# EAGLE schematic Switch (EAGLE 7.6.0)
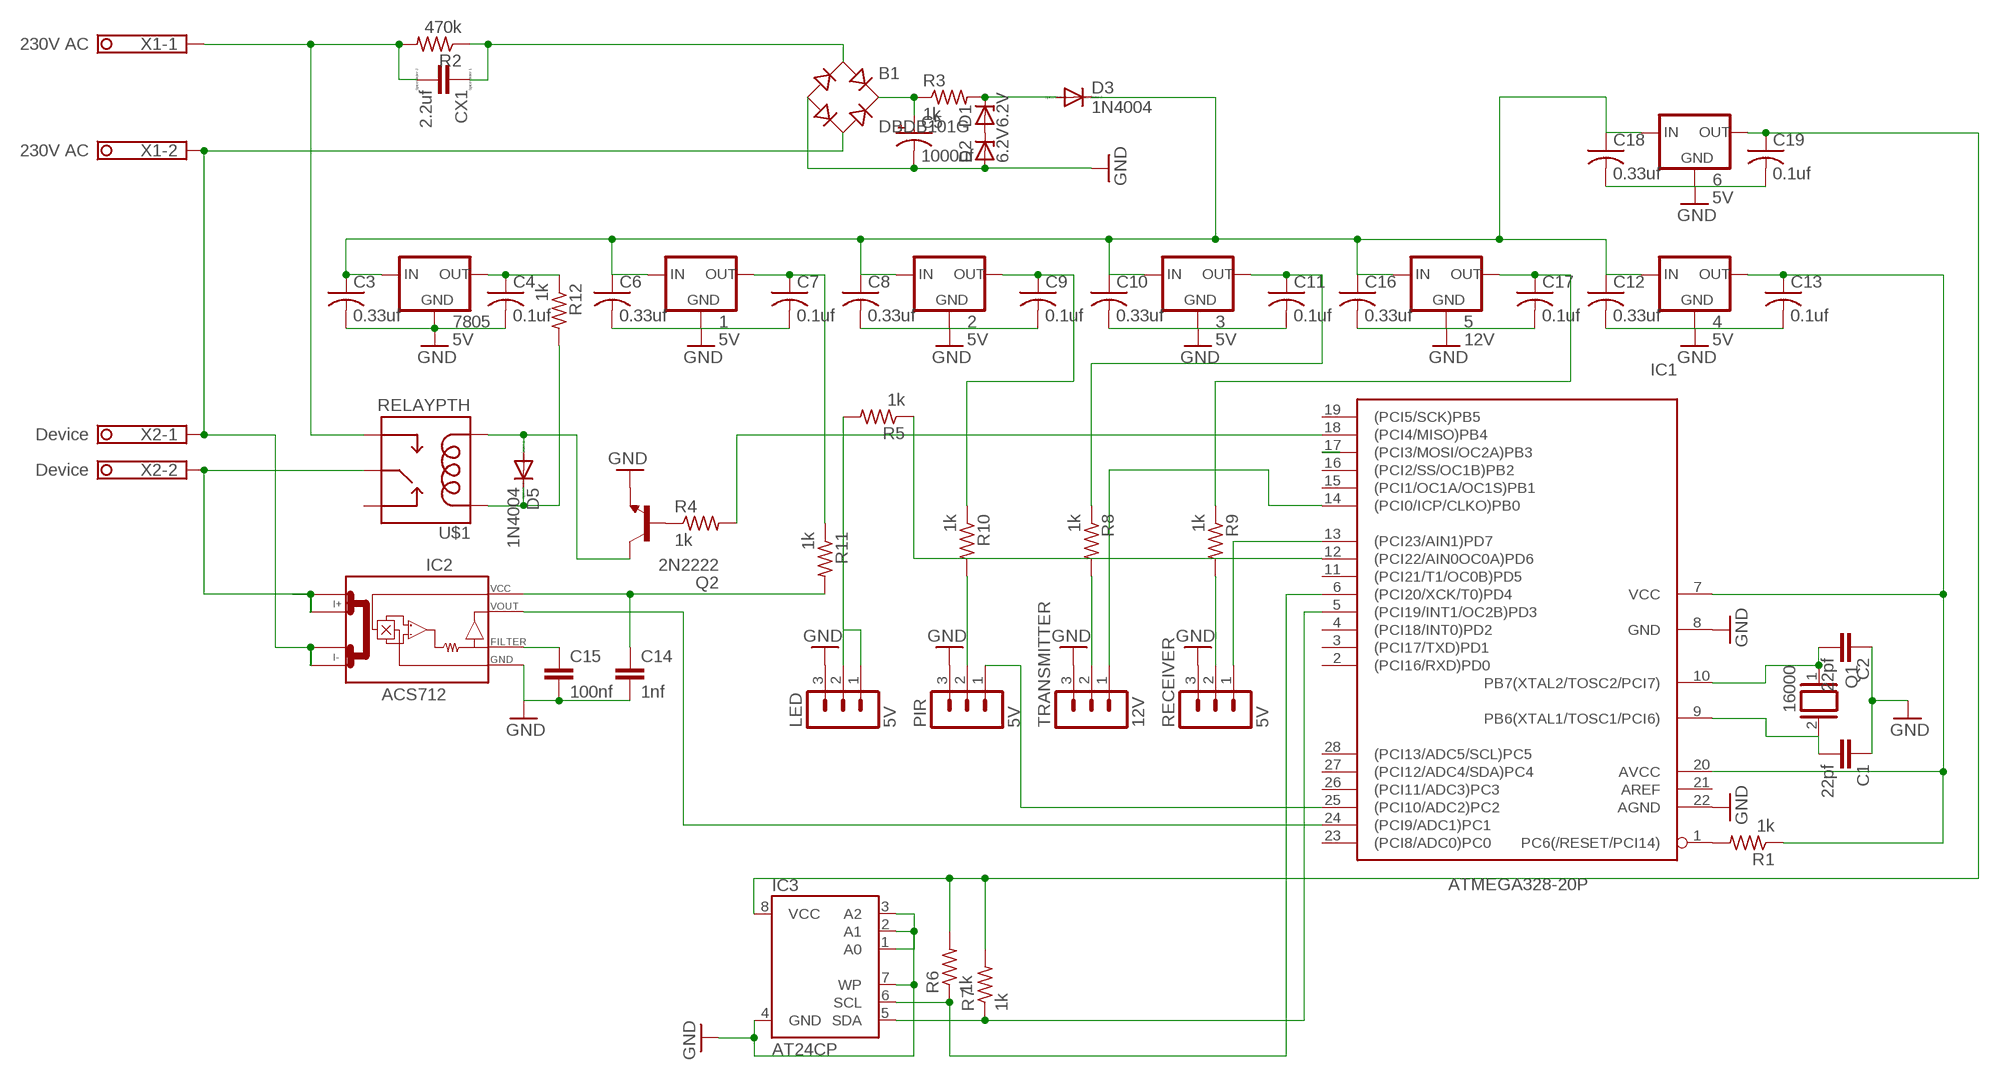
[diagram p0: schematic, sheet 1]

## Parts
1  5V  78XXL  [78XXL]
2  5V  78XXL  [78XXL]
3  5V  78XXL  [78XXL]
4  5V  78XXL  [78XXL]
5  12V  78XXL  [78XXL]
6  5V  78XXL  [78XXL]
7805  5V  78XXL  [78XXL]
B1  DBDB101G  [DB]
C1  22pf  C-EU050-030X075  [C050-030X075]
C2  22pf  C-EU050-030X075  [C050-030X075]
C3  0.33uf  C-US025-024X044  [C025-024X044]
C4  0.1uf  C-US025-024X044  [C025-024X044]
C5  1000uf  CPOL-USE2.5-7  [E2,5-7]
C6  0.33uf  C-US025-024X044  [C025-024X044]
C7  0.1uf  C-US025-024X044  [C025-024X044]
C8  0.33uf  C-US025-024X044  [C025-024X044]
C9  0.1uf  C-US025-024X044  [C025-024X044]
C10  0.33uf  C-US025-024X044  [C025-024X044]
C11  0.1uf  C-US025-024X044  [C025-024X044]
C12  0.33uf  C-US025-024X044  [C025-024X044]
C13  0.1uf  C-US025-024X044  [C025-024X044]
C14  1nf  C-EU050-025X075  [C050-025X075]
C15  100nf  C-EU050-024X044  [C050-024X044]
C16  0.33uf  C-US025-024X044  [C025-024X044]
C17  0.1uf  C-US025-024X044  [C025-024X044]
C18  0.33uf  C-US025-024X044  [C025-024X044]
C19  0.1uf  C-US025-024X044  [C025-024X044]
CX1  2.2uf  CXXC15B6  [XC15B6]
D1  6.2V  ZENER-DIODEDO35Z10  [DO35Z10]
D2  6.2V  ZENER-DIODEDO35Z10  [DO35Z10]
D3  1N4004  [DO41-10]
D5  1N4004  [DO41-10]
IC1  ATMEGA328-20P  [DIL28-3]
IC2  ACS712  [SO08]
IC3  AT24CP  [DIL08]
LED  5V  MA03-1  [MA03-1]
PIR  5V  MA03-1  [MA03-1]
Q1  16000  XTAL/S  [QS]
Q2  2N2222  [TO18]
R1  1k  R-US_0207/10  [0207/10]
R2  470k  R-US_0207/12  [0207/12]
R3  1k  R-US_0207/12  [0207/12]
R4  1k  R-US_0207/10  [0207/10]
R5  1k  R-US_0207/10  [0207/10]
R6  1k  R-US_0207/10  [0207/10]
R7  1k  R-US_0207/10  [0207/10]
R8  1k  R-US_0207/10  [0207/10]
R9  1k  R-US_0207/10  [0207/10]
R10  1k  R-US_0207/10  [0207/10]
R11  1k  R-US_0207/10  [0207/10]
R12  1k  R-US_0207/10  [0207/10]
RECEIVER  5V  MA03-1  [MA03-1]
TRANSMITTER  12V  MA03-1  [MA03-1]
U$1  RELAYPTH  [SRD-05VDC-SL-C]
X1  230V AC  1751248  [1751248]
X2  Device  1751248  [1751248]

## Nets
GND: 1.GND 2.GND 3.GND 4.GND 5.GND 6.GND 7805.GND B1.- C1.1 C2.1 C3.2 C4.2 C5.- C6.2 C7.2 C8.2 C9.2 C10.2 C11.2 C12.2 C13.2 C14.2 C15.2 C16.2 C17.2 C18.2 C19.2 D2.A IC1.8(GND) IC1.22(AGND) IC2.5(GND) IC3.1(A0) IC3.2(A1) IC3.3(A2) IC3.4(GND) IC3.7(WP) LED.3 PIR.3 Q2.1(E) RECEIVER.3 TRANSMITTER.3
N$1: C1.2 IC1.9(PB6(XTAL1/TOSC1/PCI6)) Q1.2
N$2: C2.2 IC1.10(PB7(XTAL2/TOSC2/PCI7)) Q1.1
N$3: R9.2 RECEIVER.2
N$4: IC1.1(PC6(/RESET/PCI14)) R1.2
N$5: 7805.OUT C4.1 R12.1
N$6: B1.AC1 CX1.1 R2.1
N$7 [powerac]: CX1.2 R2.2 U$1.SWOPEN X1.1
N$8: IC1.18((PCI4/MISO)PB4) R4.2
N$9: B1.+ C5.+ R3.1
N$10: 2.OUT C9.1 R10.1
N$11: D1.A D2.C
N$12: D1.C D3.A R3.2
N$13: D5.A Q2.3(C) U$1.COIL0
N$14: IC1.17((PCI3/MOSI/OC2A)PB3)
N$15: 3.OUT C11.1 R8.1
N$16: IC1.14((PCI0/ICP/CLKO)PB0) TRANSMITTER.1
N$18: 5.OUT C17.1 R9.1
N$19: IC1.5((PCI19/INT1/OC2B)PD3) IC3.5(SDA) R7.1
N$20: C15.1 IC2.6(FILTER)
N$21: D5.C R12.2 U$1.COIL1
N$22: IC1.25((PCI10/ADC2)PC2) PIR.1
N$23: IC1.12((PCI22/AIN0OC0A)PD6) R5.1
N$24: LED.1 LED.2 R5.2
N$25 [powerac]: B1.AC2 IC2.3(I-_0) IC2.4(I-_1) X1.2 X2.1
N$26: IC1.13((PCI23/AIN1)PD7) RECEIVER.1
N$27: IC1.24((PCI9/ADC1)PC1) IC2.7(VOUT)
N$28: C14.1 IC2.8(VCC) R11.2
N$29: IC1.6((PCI20/XCK/T0)PD4) IC3.6(SCL) R6.1
N$30: 6.OUT C19.1 IC3.8(VCC) R6.2 R7.2
N$31: R8.2 TRANSMITTER.2
N$32: 1.IN 2.IN 3.IN 4.IN 5.IN 6.IN 7805.IN C3.1 C6.1 C8.1 C10.1 C12.1 C16.1 C18.1 D3.C
N$33: PIR.2 R10.2
N$34: 1.OUT C7.1 R11.1
N$35: Q2.2(B) R4.1
N$38: 4.OUT C13.1 IC1.7(VCC) IC1.20(AVCC) R1.1
N$39 [powerac]: IC2.1(I+_0) IC2.2(I+_1) U$1.SWCOMMON X2.2
Unconnected: IC1.2((PCI16/RXD)PD0) IC1.3((PCI17/TXD)PD1) IC1.4((PCI18/INT0)PD2) IC1.11((PCI21/T1/OC0B)PD5) IC1.15((PCI1/OC1A/OC1S)PB1) IC1.16((PCI2/SS/OC1B)PB2) IC1.19((PCI5/SCK)PB5) IC1.21(AREF) IC1.23((PCI8/ADC0)PC0) IC1.26((PCI11/ADC3)PC3) IC1.27((PCI12/ADC4/SDA)PC4) IC1.28((PCI13/ADC5/SCL)PC5) U$1.SWCLOSED(SWCLOSE)

## Notes on the sheet
- ForeRunners

## Library data of the parts
1-6 7805 = v-reg:78XXL: VOLTAGE REGULATOR
B1 = rectifier:DB?*G: Single Phase 1.0 AMP Glass Passivated Bridge Rectifier Taiwan Semiconductor Co.,Ltd. - TSC Source: http://www.taiwansemi.com/TSCbig5/ezcatfiles/cust/img/img/db101g.pdf http://www.ts.com.tw/db/pictures/modules/PDT/PDT060207001/DBLS201G.pdf
C1 C2 C14 C15 = rcl:C-EU: CAPACITOR, European symbol
C3 C4 C6-C13 C16-C19 = rcl:C-US: CAPACITOR, American symbol
C5 = rcl:CPOL-US: POLARIZED CAPACITOR, American symbol
CX1 = resistor:CX: X CAPACITOR for power line
D1 D2 = diode:ZENER-DIODE: Z-Diode
D3 D5 = diode:1N4004: DIODE general purpose rectifier, 1 A
IC1 = atmega328:ATMEGA328*P: MICROCONTROLLER 32 kBytes FLASH 2 kBytes SRAM 1 kBytes EEPROM USART 8-channel 10 bit ADC
IC2 = ACS712:ACS712
IC3 = EEPROM:AT24C*: 2-wire serial EEPROM; MPN: AT24C1024BW-SH-B; OC_FARNELL: 1362646; OC_NEWARK: 03P2044
LED PIR RECEIVER TRANSMITTER = con-lstb:MA03-1: PIN HEADER; OC_FARNELL: unknown; OC_NEWARK: unknown
Q1 = special:XTAL/S: CRYSTAL
Q2 = transistor-npn:2N2222*: NPN Transistor
R1 R3-R12 = rcl:R-US_: RESISTOR, American symbol
R2 = rcl:R-US_: RESISTOR, American symbol; WATT: 1
U$1 = SRD-05VDC-SL-C:RELAY: SPDT relay (COM-00101)
X1 X2 = con-phoenix-350:1751248: MKDS 1/ 2-3,5 Printklemme Nennstrom: 10 A Bemessungsspannung: 160 V Raster: 3,5 mm Polzahl: 2 Montageart: Löten Anschlussart: Schraubanschluss Anschlussrichtung vom Leiter zur Platine: 0° Source: http://eshop.phoenixcontact.com .. 1751248.pdf; OC_FARNELL: unknown; OC_NEWARK: unknown

## Net classes
0 default: width 0.102 mm, drill 0.254 mm, clearance 0.381 mm
1 powerac: width 0.076 mm, drill 0.051 mm, clearance 0.508 mm